# EAGLE design XuLA (EAGLE 5.10)
AUTHOR: Dave Vandenbout / XESS Corp.; DIGIKEY#: 445-3447-1-ND; MANF: Winbond; MANF#: C1005Y5V1H103Z; MOUSER#: 810-C1005Y5V1H103Z; VERSION#: 1.0

## Sheet 1 of 2
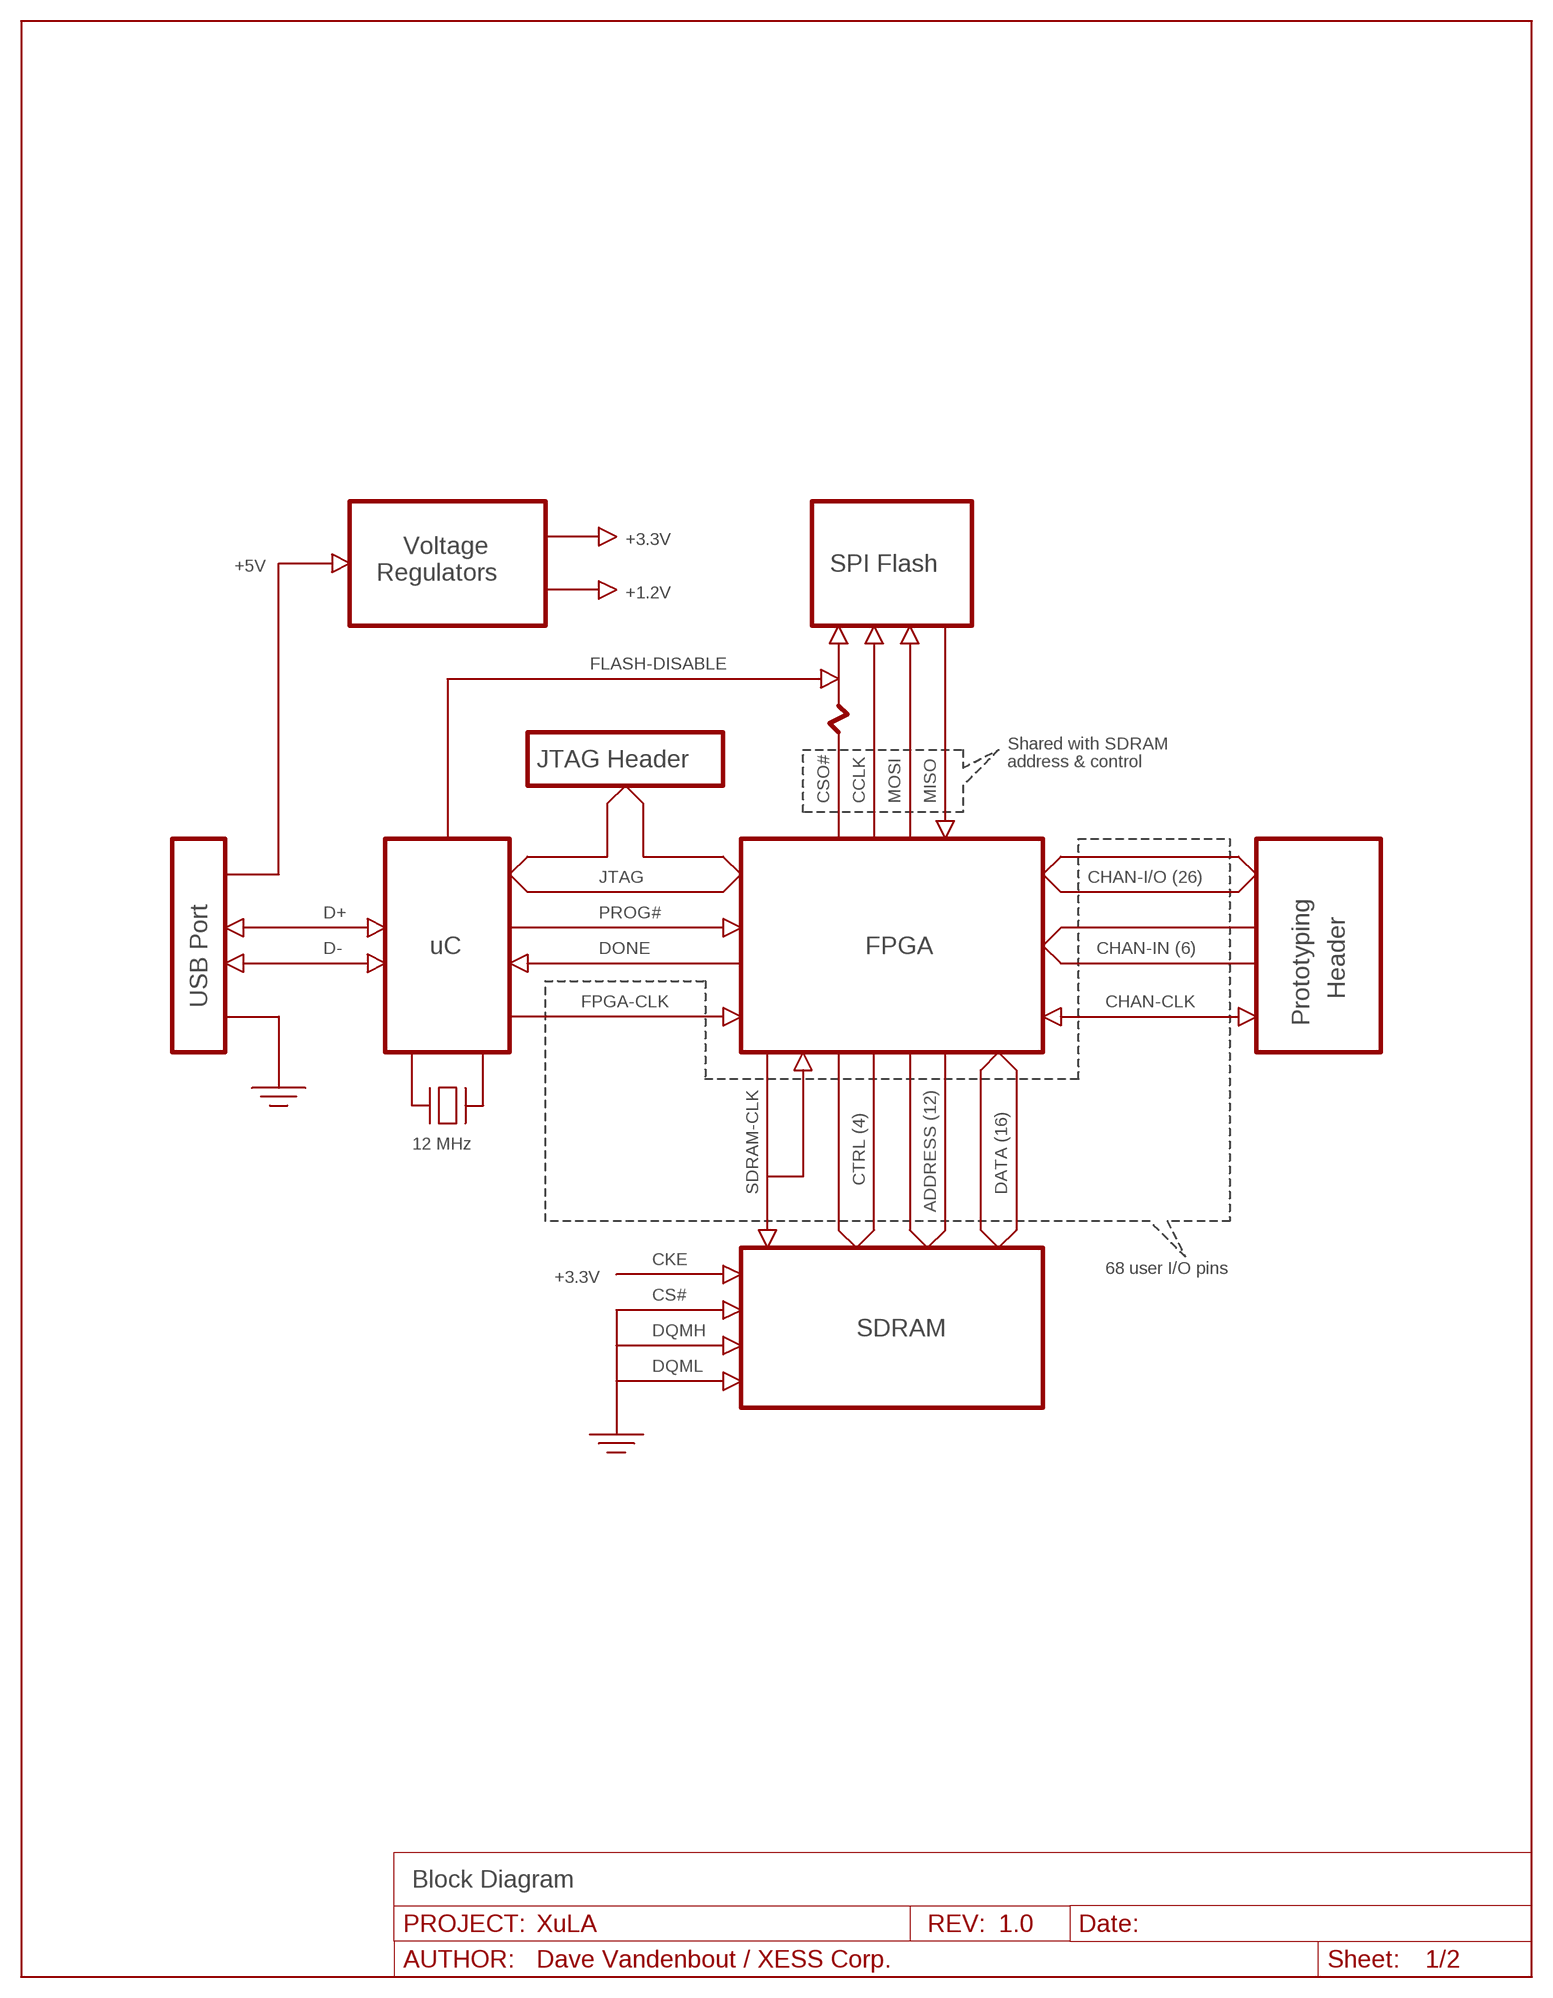
[diagram p0: schematic, sheet 1]

### Notes on the sheet
- +3.3V
- Voltage
- +5V | SPI Flash
- Regulators
- +1.2V
- FLASH-DISABLE
- Shared with SDRAM
- JTAG Header | address & control
- CSO# | CCLK | MOSI | MISO
- JTAG | CHAN-I/O (26)
- D+ | PROG#
- D- | uC | DONE | FPGA | CHAN-IN (6)
- Header
- USB Port | FPGA-CLK | CHAN-CLK
- Prototyping
- 12 MHz
- CTRL (4)
- SDRAM-CLK | DATA (16)
- ADDRESS (12)
- CKE
- 68 user I/O pins
- +3.3V
- CS#
- DQMH | SDRAM
- DQML
- Block Diagram

## Sheet 2 of 2
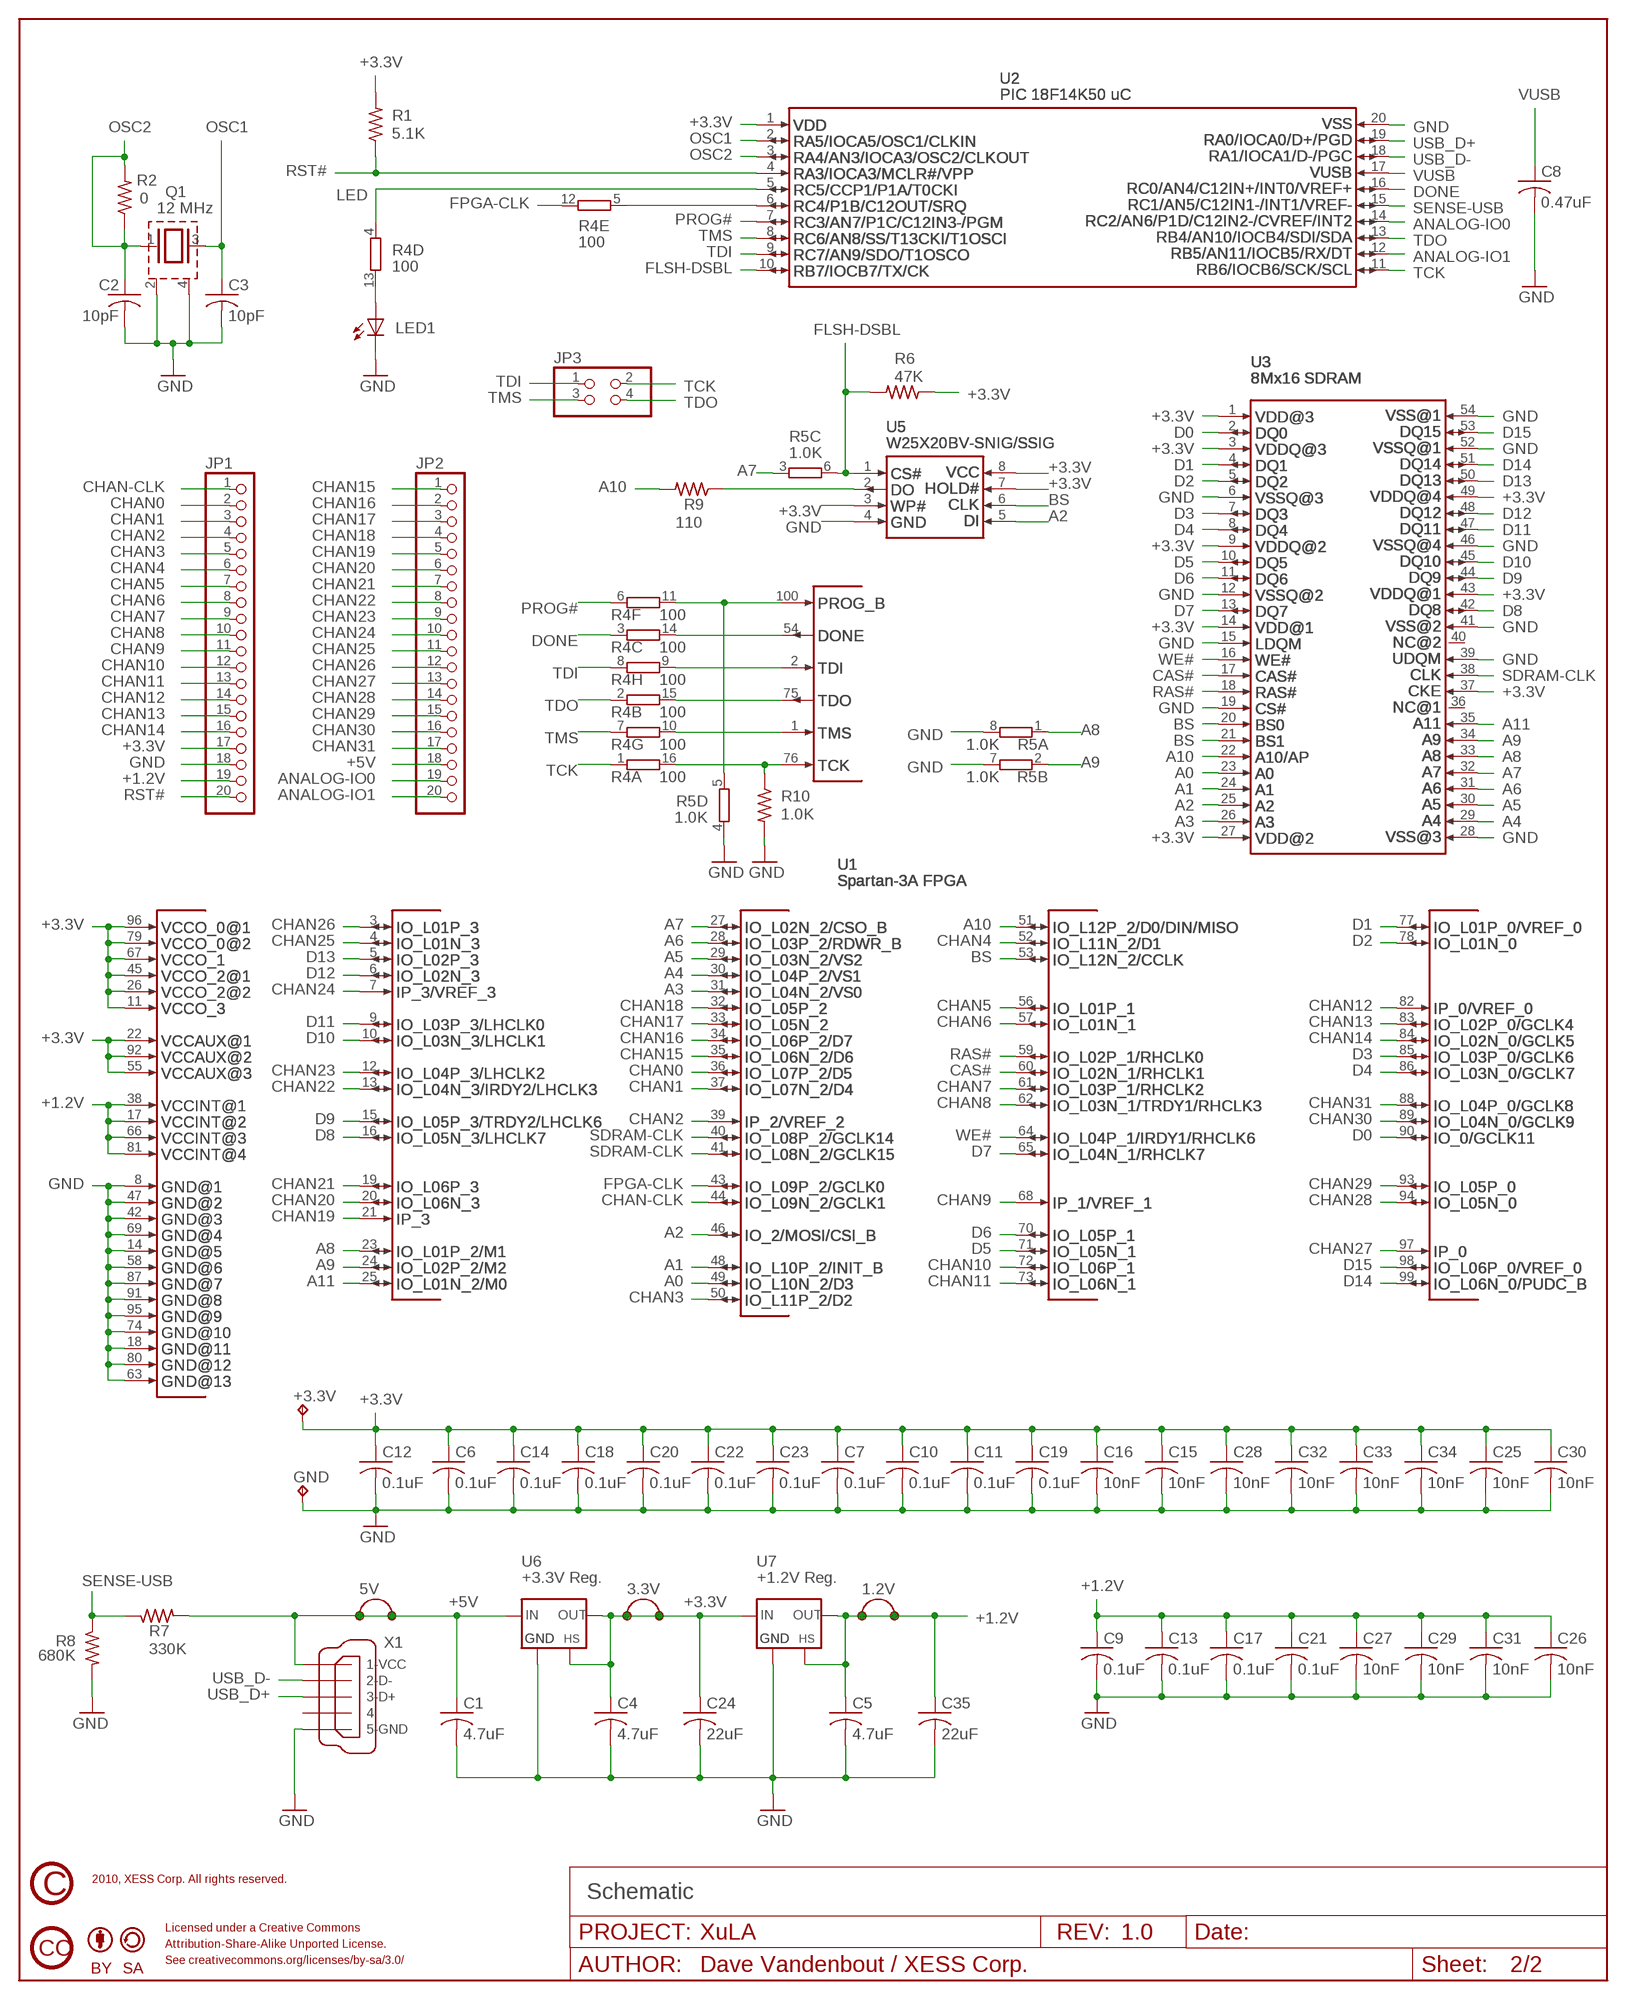
[diagram p1: schematic, sheet 2]

### Parts
1.2V  JP1QNOSILK  [JP1-NOSILK]
3.3V  JP1QNOSILK  [JP1-NOSILK]
5V  JP1QNOSILK  [JP1-NOSILK]
+3.3V  TPTP-MINI  [TP-MINI]
C1  4.7uF  C-USC0603  [C0603]
C2  10pF  C-USC0603  [C0603]
C3  10pF  C-USC0603  [C0603]
C4  4.7uF  C-USC0603  [C0603]
C5  4.7uF  C-USC0603  [C0603]
C6  0.1uF  C-USC0603  [C0603]
C7  0.1uF  C-USC0603  [C0603]
C8  0.47uF  C-USC0603  [C0603]
C9  0.1uF  C-USC0603  [C0603]
C10  0.1uF  C-USC0603  [C0603]
C11  0.1uF  C-USC0603  [C0603]
C12  0.1uF  C-USC0603  [C0603]
C13  0.1uF  C-USC0603  [C0603]
C14  0.1uF  C-USC0603  [C0603]
C15  10nF  C-USC0402  [C0402]
C16  10nF  C-USC0402  [C0402]
C17  0.1uF  C-USC0603  [C0603]
C18  0.1uF  C-USC0603  [C0603]
C19  0.1uF  C-USC0603  [C0603]
C20  0.1uF  C-USC0603  [C0603]
C21  0.1uF  C-USC0603  [C0603]
C22  0.1uF  C-USC0603  [C0603]
C23  0.1uF  C-USC0603  [C0603]
C24  22uF  C-USC1210  [C1210]
C25  10nF  C-USC0402  [C0402]
C26  10nF  C-USC0402  [C0402]
C27  10nF  C-USC0402  [C0402]
C28  10nF  C-USC0402  [C0402]
C29  10nF  C-USC0402  [C0402]
C30  10nF  C-USC0402  [C0402]
C31  10nF  C-USC0402  [C0402]
C32  10nF  C-USC0402  [C0402]
C33  10nF  C-USC0402  [C0402]
C34  10nF  C-USC0402  [C0402]
C35  22uF  C-USC1210  [C1210]
GND  TPTP-MINI  [TP-MINI]
JP1  PINHD-1X20NOSILK  [1X20-NOSILK]
JP2  PINHD-1X20NOSILK  [1X20-NOSILK]
JP3  PINHD-2X2NOSILK  [2X02-NOSILK]
LED1  LED0603  [CHIPLED-0603-TTW]
Q1  12 MHz  XTAL_CHIP32X25  [32X25]
R1  5.1K  R-US_R0603  [R0603]
R2  0  R-US_R0603  [R0603]
R4  100  RES8741X  [741X163]
R5  1.0K  RES4742  [742C083]
R6  47K  R-US_R0603  [R0603]
R7  330K  R-US_R0603  [R0603]
R8  680K  R-US_R0603  [R0603]
R9  110  R-US_R0603  [R0603]
R10  1.0K  R-US_R0603  [R0603]
U1  Spartan-3A FPGA  XC3S200A-VQ100  [XILINX-VQ100]
U2  PIC 18F14K50 uC  PIC18F14K50-I/SS  [MICROCHIP-20_SSOP]
U3  8Mx16 SDRAM  W9812G6JH  [TSOPII-54]
U5  W25X20BV-SNIG/SSIG  W25X10BV-SNIG/SSIG  [WINBOND-8_SOIC_150_208]
U6  +3.3V Reg.  FAN1117  [SOT223]
U7  +1.2V Reg.  FAN1112  [SOT223]
U$2  CC_CC  [CC_CC]
U$3  CC_BY  [CC_BY]
U$4  CC_SA  [CC_SA]
U$5  CC_COPYRIGHT  [CC_COPYRIGHT]
X1  MINI-USB-UX60SC-MB-5STUX60SC-MB-5ST  [UX60SC-MB-5ST]

### Nets
+1.2V: 1.2V.1 1.2V.2 C5.1 C9.1 C13.1 C17.1 C21.1 C26.1 C27.1 C29.1 C31.1 C35.1 JP1.19 U1.17 U1.38 U1.66 U1.81 U7.2(OUT) U7.4(HS)
+3.3V: 3.3V.1 3.3V.2 +3.3V.1(TP) C4.1 C6.1 C7.1 C10.1 C11.1 C12.1 C14.1 C15.1 C16.1 C18.1 C19.1 C20.1 C22.1 C23.1 C24.1 C25.1 C28.1 C30.1 C32.1 C33.1 C34.1 JP1.17 R1.2 R6.1 U1.11 U1.22 U1.26 U1.45 U1.55 U1.67 U1.79 U1.92 U1.96 U2.1 U3.1 U3.3 U3.9 U3.14 U3.27 U3.37 U3.43 U3.49 U5.3 U5.7 U5.8 U6.2(OUT) U6.4(HS) U7.3(IN)
+5V: 5V.1 5V.2 C1.1 JP2.18 R7.2 U6.3(IN) X1.1(1-VCC)
A0: U1.49 U3.23
A1: U1.48 U3.24
A2: U1.46 U3.25 U5.5
A3: U1.31 U3.26
A4: U1.30 U3.29
A5: U1.29 U3.30
A6: U1.28 U3.31
A7: R5.3 U1.27 U3.32
A8: R5.1 U1.23 U3.33
A9: R5.2 U1.24 U3.34
A10: R9.2 U1.51 U3.22
A11: U1.25 U3.35
ANALOG-IO0: JP2.19 U2.14
ANALOG-IO1: JP2.20 U2.12
BS: U1.53 U3.20 U3.21 U5.6
CAS#: U1.60 U3.17
CHAN0: JP1.2 U1.36
CHAN1: JP1.3 U1.37
CHAN2: JP1.4 U1.39
CHAN3: JP1.5 U1.50
CHAN4: JP1.6 U1.52
CHAN5: JP1.7 U1.56
CHAN6: JP1.8 U1.57
CHAN7: JP1.9 U1.61
CHAN8: JP1.10 U1.62
CHAN9: JP1.11 U1.68
CHAN10: JP1.12 U1.72
CHAN11: JP1.13 U1.73
CHAN12: JP1.14 U1.82
CHAN13: JP1.15 U1.83
CHAN14: JP1.16 U1.84
CHAN15: JP2.1 U1.35
CHAN16: JP2.2 U1.34
CHAN17: JP2.3 U1.33
CHAN18: JP2.4 U1.32
CHAN19: JP2.5 U1.21
CHAN20: JP2.6 U1.20
CHAN21: JP2.7 U1.19
CHAN22: JP2.8 U1.13
CHAN23: JP2.9 U1.12
CHAN24: JP2.10 U1.7
CHAN25: JP2.11 U1.4
CHAN26: JP2.12 U1.3
CHAN27: JP2.13 U1.97
CHAN28: JP2.14 U1.94
CHAN29: JP2.15 U1.93
CHAN30: JP2.16 U1.89
CHAN31: JP2.17 U1.88
CHAN-CLK: JP1.1 U1.44
D0: U1.90 U3.2
D1: U1.77 U3.4
D2: U1.78 U3.5
D3: U1.85 U3.7
D4: U1.86 U3.8
D5: U1.71 U3.10
D6: U1.70 U3.11
D7: U1.65 U3.13
D8: U1.16 U3.42
D9: U1.15 U3.44
D10: U1.10 U3.45
D11: U1.9 U3.47
D12: U1.6 U3.48
D13: U1.5 U3.50
D14: U1.99 U3.51
D15: U1.98 U3.53
DONE: R4.3 U2.16
FLSH-DSBL: R5.6 R6.2 U2.10 U5.1
FPGA-CLK: R4.12 U1.43
GND: C1.2 C2.2 C3.2 C4.2 C5.2 C6.2 C7.2 C8.2 C9.2 C10.2 C11.2 C12.2 C13.2 C14.2 C15.2 C16.2 C17.2 C18.2 C19.2 C20.2 C21.2 C22.2 C23.2 C24.2 C25.2 C26.2 C27.2 C28.2 C29.2 C30.2 C31.2 C32.2 C33.2 C34.2 C35.2 GND.1(TP) JP1.18 LED1.C Q1.2 Q1.4 R5.4 R5.7 R5.8 R8.2 R10.2 U1.8 U1.14 U1.18 U1.42 U1.47 U1.58 U1.63 U1.69 U1.74 U1.80 U1.87 U1.91 U1.95 U2.20 U3.6 U3.12 U3.15 U3.19 U3.28 U3.39 U3.41 U3.46 U3.52 U3.54 U5.4 U6.1(GND) U7.1(GND) X1.5(5-GND)
LED: R4.4 U2.5
N$1: R4.16 R10.1 U1.76
N$2: R4.10 U1.1
N$3: R4.9 U1.2
N$4: R4.15 U1.75
N$5: R4.11 R5.5 U1.100
N$6: R4.14 U1.54
N$7: R4.5 U2.6
N$8: R9.1 U5.2
N$11: LED1.A R4.13
OSC1: C3.1 Q1.3 U2.2
OSC2: C2.1 Q1.1 R2.1 R2.2 U2.3
PROG#: R4.6 U2.7
RAS#: U1.59 U3.18
RST#: JP1.20 R1.1 U2.4
SDRAM-CLK: U1.40 U1.41 U3.38
SENSE-USB: R7.1 R8.1 U2.15
TCK: JP3.2 R4.1 U2.11
TDI: JP3.1 R4.8 U2.9
TDO: JP3.4 R4.2 U2.13
TMS: JP3.3 R4.7 U2.8
USB_D+: U2.19 X1.3(3-D+)
USB_D-: U2.18 X1.2(2-D-)
VUSB: C8.1 U2.17
WE#: U1.64 U3.16
Unconnected: U3.36 U3.40 X1.4

### Notes on the sheet
- 2010, XESS Corp. All rights reserved.
- Schematic
- Licensed under a Creative Commons
- Attribution-Share-Alike Unported License.
- See creativecommons.org/licenses/by-sa/3.0/

## Library data of the parts
1.2V 3.3V 5V = xess:JP1Q: JUMPER
+3.3V GND = xess:TP: Test Point
C1-C35 = rcl:C-US: CAPACITOR, American symbol
JP1 JP2 = pinhead:PINHD-1X20: PIN HEADER
JP3 = pinhead:PINHD-2X2: PIN HEADER
LED1 = xess:LED: LED
Q1 = xess:XTAL_CHIP: Crystal Chip
R1 R2 R6-R10 = rcl:R-US_: RESISTOR, American symbol
R4 = xess:RES8: Resistor 8-pack Package of eight resistors.
R5 = xess:RES4: Resistor 4-pack Package of four resistors.
U1 = xess:XC3S200A-VQ100: Xilinx Spartan 3A 200K-gate FPGA in VQ100 package
U2 = xess:PIC18F14K50: Microchip PIC 18F14K50 Microcontroller
U3 = xess:W9812G6JH: 8M x 16 SDRAM 128Mb synchronous DRAM.
U5 = xess:W25X10BV: Winbond W25X10BV/20BV/40BV SPI Flash
U6 = xess:FAN1117: +3.3V Linear Regulator
U7 = xess:FAN1112: +1.2V Linear Regulator
U$2 = xess:CC_CC
U$3 = xess:CC_BY
U$4 = xess:CC_SA
U$5 = xess:CC_COPYRIGHT
X1 = xess:MINI-USB-: MINI USB Connector Source: http://www.hirose.co.jp/cataloge_hp/e24000019.pdf

## Net classes
1 power: clearance 0.254 mm

## Board
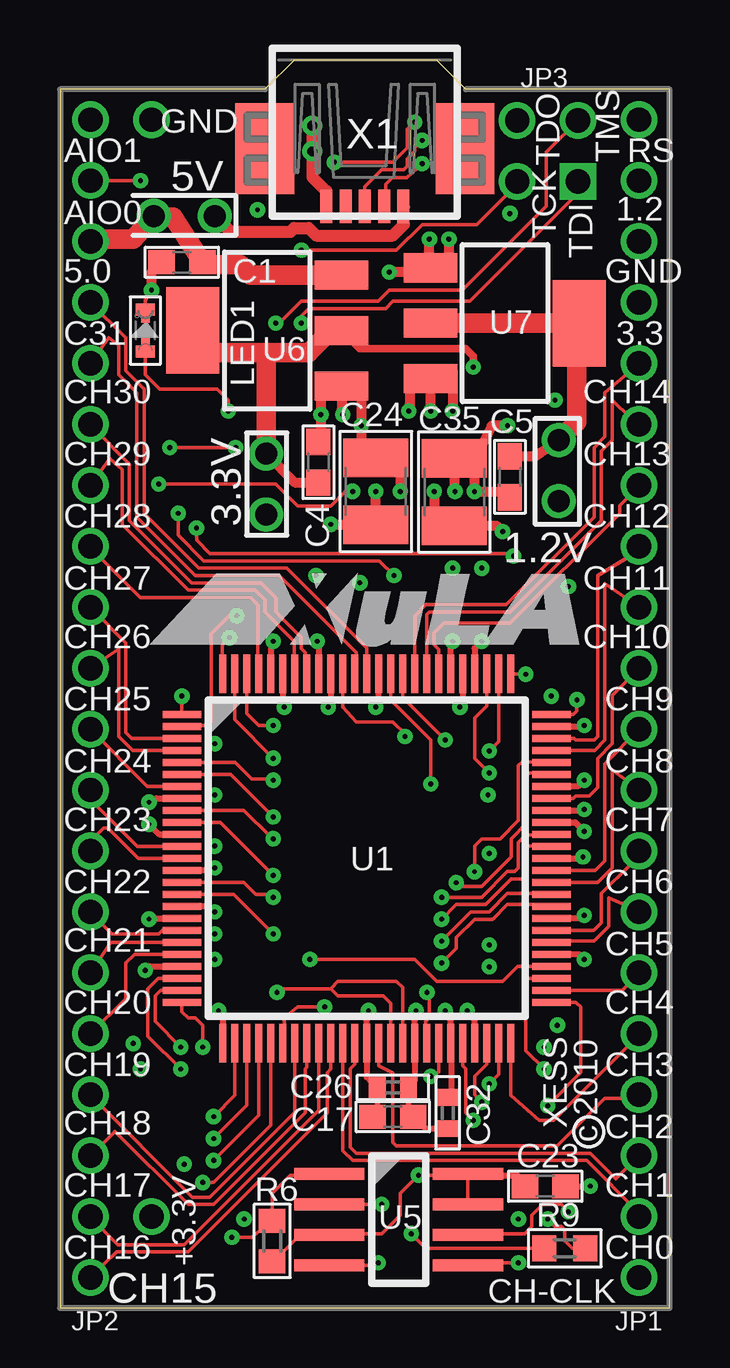
[diagram p2: board, top side]
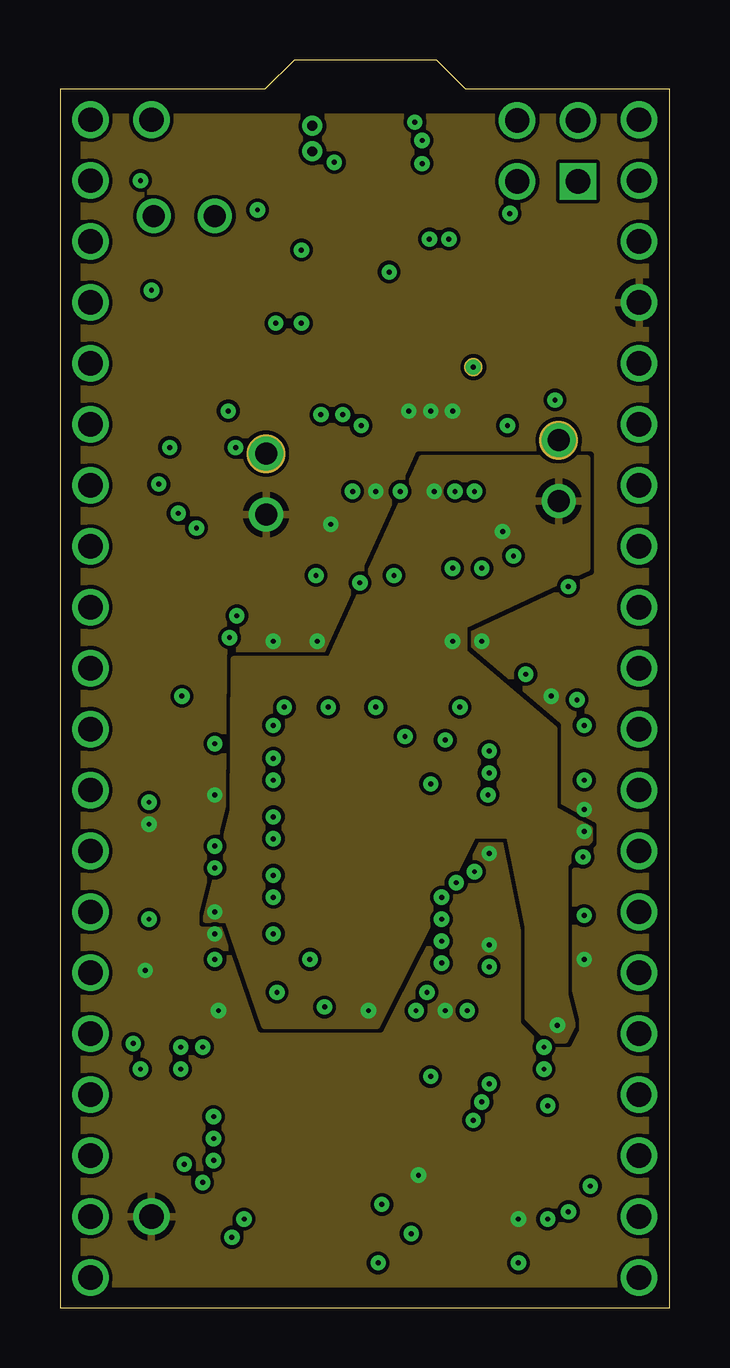
[diagram p3: board, inner layer Route3]
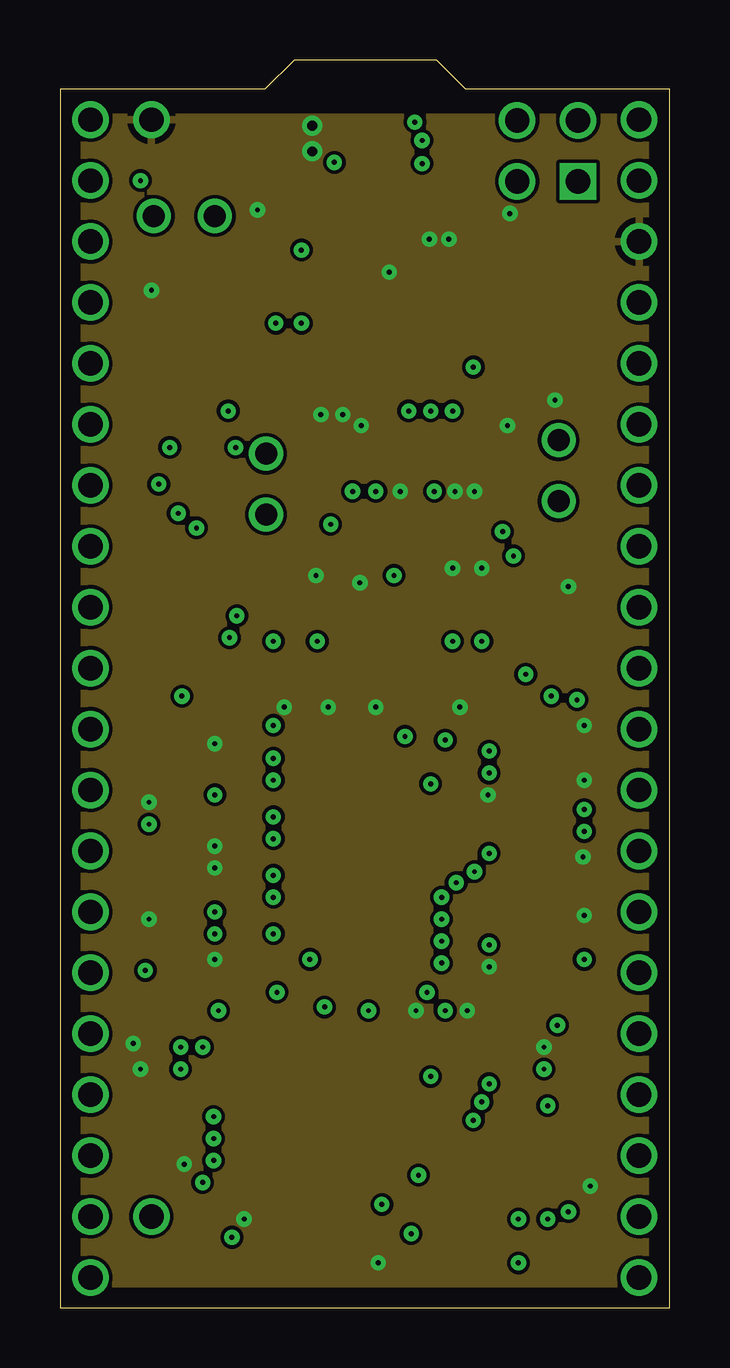
[diagram p4: board, inner layer Route4]
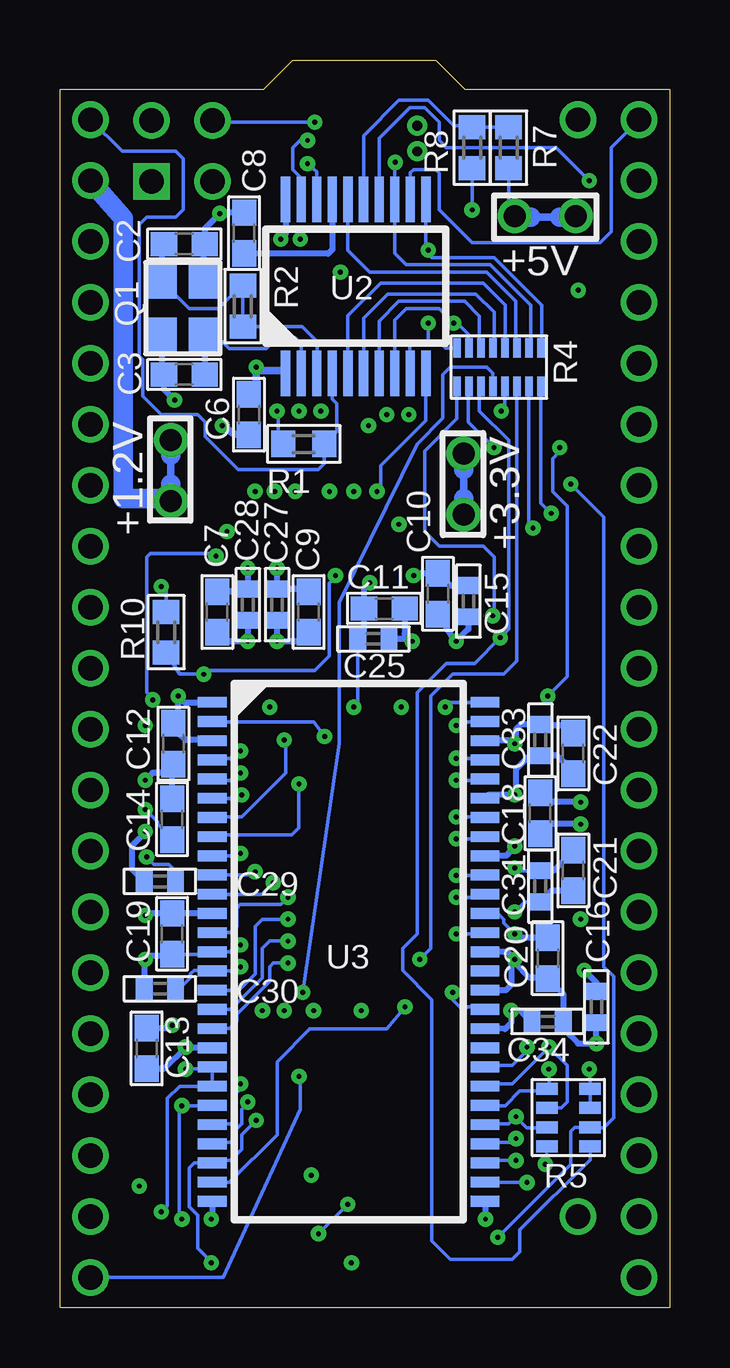
[diagram p5: board, bottom side, seen from below]

Size 25.4 x 52.02 mm. Coordinates in mm from the lower left corner, seen from the top.
Outline: 0,50.8 0,0 25.4,0 25.4,50.8 16.92,50.8 15.7,52.02 9.75,52.02 8.53,50.8 0,50.8
Copper layers (1+3*4+16): Top 0.035mm / dielectric 0.3048mm / Route3 0.07mm / dielectric 0.3048mm / Route4 0.07mm / dielectric 0.3048mm / Bottom 0.035mm
Design rules "logic_popper": minimum track width 6mil, minimum drill 8mil, track to track 6mil, track to pad 6mil, pad to pad 6mil, via to via 6mil, smd to smd 6mil, copper to edge 20mil, drill to drill 8mil, minimum pad ring 10mil, minimum via ring 8.5mil, stop-mask expansion 4mil, vias tented up to drill 20mil, thermal gap 10mil

### Footprints (pad centres in the part's own frame; a part is rotated, then mirrored left to right if it is on the bottom)
JP1-NOSILK = drill 0.914 round: 1 0,-1.27; 2 0,1.27
TP-MINI = drill 1.016 round: 1 0,0
C0603 = smd 1.1 x 1: 1 -0.85,0; 2 0.85,0
C0402 = smd 0.7 x 0.9: 1 -0.65,0; 2 0.65,0
C1210 = smd 1.6 x 2.7: 1 -1.4,0; 2 1.4,0
1X20-NOSILK = drill 1.016 round: 1 -24.13,0; 2 -21.59,0; 3 -19.05,0; 4 -16.51,0; 5 -13.97,0; 6 -11.43,0; 7 -8.89,0; 8 -6.35,0; 9 -3.81,0; 10 -1.27,0; 11 1.27,0; 12 3.81,0; 13 6.35,0; 14 8.89,0; 15 11.43,0; 16 13.97,0; 17 16.51,0; 18 19.05,0; 19 21.59,0; 20 24.13,0
2X02-NOSILK = drill 1.016 square: 1 -1.27,-1.27 | drill 1.016 round: 2 -1.27,1.27; 3 1.27,-1.27; 4 1.27,1.27
CHIPLED-0603-TTW = smd 0.8 x 0.5: A 0,-0.875; C 0,0.875 | smd 0.35 x 0.35: A@1 0,-0.5; C@1 0,0.5
32X25 = smd 1.2 x 1.4: 1 0,0; 2 0,-2.2; 3 1.7,-2.2; 4 1.7,0
R0603 = smd 1 x 1.1: 1 -0.85,0; 2 0.85,0
741X163 = smd 0.3 x 0.8: 1 -1.75,-0.8; 2 -1.25,-0.8; 3 -0.75,-0.8; 4 -0.25,-0.8; 5 0.25,-0.8; 6 0.75,-0.8; 7 1.25,-0.8; 8 1.75,-0.8; 9 1.75,0.8; 10 1.25,0.8; 11 0.75,0.8; 12 0.25,0.8; 13 -0.25,0.8; 14 -0.75,0.8; 15 -1.25,0.8; 16 -1.75,0.8
742C083 = smd 0.5 x 0.9: 1 -0.4,-0.9; 2 0.4,-0.9; 3 1.2,-0.9; 4 2,-0.9; 5 2,0.9; 6 1.2,0.9; 7 0.4,0.9; 8 -0.4,0.9
XILINX-VQ100 = smd 1.6 x 0.3: 1 0,0; 2 0,-0.5; 3 0,-1; 4 0,-1.5; 5 0,-2; 6 0,-2.5; 7 0,-3; 8 0,-3.5; 9 0,-4; 10 0,-4.5; 11 0,-5; 12 0,-5.5; 13 0,-6; 14 0,-6.5; 15 0,-7; 16 0,-7.5; 17 0,-8; 18 0,-8.5; 19 0,-9; 20 0,-9.5; 21 0,-10; 22 0,-10.5; 23 0,-11; 24 0,-11.5; 25 0,-12; 51 15.4,-12; 52 15.4,-11.5; 53 15.4,-11; 54 15.4,-10.5; 55 15.4,-10; 56 15.4,-9.5; 57 15.4,-9; 58 15.4,-8.5; 59 15.4,-8; 60 15.4,-7.5; 61 15.4,-7; 62 15.4,-6.5; 63 15.4,-6; 64 15.4,-5.5; 65 15.4,-5; 66 15.4,-4.5; 67 15.4,-4; 68 15.4,-3.5; 69 15.4,-3; 70 15.4,-2.5; 71 15.4,-2; 72 15.4,-1.5; 73 15.4,-1; 74 15.4,-0.5; 75 15.4,0 | smd 0.3 x 1.6: 26 1.7,-13.7; 27 2.2,-13.7; 28 2.7,-13.7; 29 3.2,-13.7; 30 3.7,-13.7; 31 4.2,-13.7; 32 4.7,-13.7; 33 5.2,-13.7; 34 5.7,-13.7; 35 6.2,-13.7; 36 6.7,-13.7; 37 7.2,-13.7; 38 7.7,-13.7; 39 8.2,-13.7; 40 8.7,-13.7; 41 9.2,-13.7; 42 9.7,-13.7; 43 10.2,-13.7; 44 10.7,-13.7; 45 11.2,-13.7; 46 11.7,-13.7; 47 12.2,-13.7; 48 12.7,-13.7; 49 13.2,-13.7; 50 13.7,-13.7; 76 13.7,1.7; 77 13.2,1.7; 78 12.7,1.7; 79 12.2,1.7; 80 11.7,1.7; 81 11.2,1.7; 82 10.7,1.7; 83 10.2,1.7; 84 9.7,1.7; 85 9.2,1.7; 86 8.7,1.7; 87 8.2,1.7; 88 7.7,1.7; 89 7.2,1.7; 90 6.7,1.7; 91 6.2,1.7; 92 5.7,1.7; 93 5.2,1.7; 94 4.7,1.7; 95 4.2,1.7; 96 3.7,1.7; 97 3.2,1.7; 98 2.7,1.7; 99 2.2,1.7; 100 1.7,1.7
MICROCHIP-20_SSOP = smd 1.89 x 0.38: 1 0,0; 2 0,-0.65; 3 0,-1.3; 4 0,-1.95; 5 0,-2.6; 6 0,-3.25; 7 0,-3.9; 8 0,-4.55; 9 0,-5.2; 10 0,-5.85; 11 7.25,-5.85; 12 7.25,-5.2; 13 7.25,-4.55; 14 7.25,-3.9; 15 7.25,-3.25; 16 7.25,-2.6; 17 7.25,-1.95; 18 7.25,-1.3; 19 7.25,-0.65; 20 7.25,0
TSOPII-54 = smd 1.2 x 0.45: 1 0,0; 2 0,-0.8; 3 0,-1.6; 4 0,-2.4; 5 0,-3.2; 6 0,-4; 7 0,-4.8; 8 0,-5.6; 9 0,-6.4; 10 0,-7.2; 11 0,-8; 12 0,-8.8; 13 0,-9.6; 14 0,-10.4; 15 0,-11.2; 16 0,-12; 17 0,-12.8; 18 0,-13.6; 19 0,-14.4; 20 0,-15.2; 21 0,-16; 22 0,-16.8; 23 0,-17.6; 24 0,-18.4; 25 0,-19.2; 26 0,-20; 27 0,-20.8; 28 11.36,-20.8; 29 11.36,-20; 30 11.36,-19.2; 31 11.36,-18.4; 32 11.36,-17.6; 33 11.36,-16.8; 34 11.36,-16; 35 11.36,-15.2; 36 11.36,-14.4; 37 11.36,-13.6; 38 11.36,-12.8; 39 11.36,-12; 40 11.36,-11.2; 41 11.36,-10.4; 42 11.36,-9.6; 43 11.36,-8.8; 44 11.36,-8; 45 11.36,-7.2; 46 11.36,-6.4; 47 11.36,-5.6; 48 11.36,-4.8; 49 11.36,-4; 50 11.36,-3.2; 51 11.36,-2.4; 52 11.36,-1.6; 53 11.36,-0.8; 54 11.36,0
WINBOND-8_SOIC_150_208 = smd 2.921 x 0.51: 1 1.06,0; 2 1.06,-1.27; 3 1.06,-2.54; 4 1.06,-3.81; 5 6.839,-3.81; 6 6.839,-2.54; 7 6.839,-1.27; 8 6.839,0
SOT223 = smd 1.219 x 2.235: 1 -2.311,-3.099; 2 0,-3.099; 3 2.311,-3.099 | smd 3.6 x 2.2: 4 0,3.099
UX60SC-MB-5ST = smd 1.4 x 0.5: 1 6.1,1.6; 2 6.1,0.8; 3 6.1,0; 4 6.1,-0.8; 5 6.1,-1.6 | smd 3.8 x 2.449: M1 3.7,-4.175; M2 3.7,4.175

### Placement (x,y rotation side)
1.2V  20.78,34.9 180 top
3.3V  8.59,34.34 180 top
5V  5.18,45.52 90 top
+3.3V  3.81,3.81 270 top
C1  5.08,43.59 180 top
C2  20.22,44.35 0 bottom
C3  20.22,38.91 180 bottom
C4  10.77,35.26 90 top
C5  18.75,34.65 270 top
C6  17.53,37.24 270 bottom
C7  18.85,29.01 90 bottom
C8  17.73,44.81 90 bottom
C9  15.04,29.01 90 bottom
C10  9.65,29.77 90 bottom
C11  11.89,29.16 180 bottom
C12  20.68,23.52 270 bottom
C13  21.79,10.82 270 bottom
C14  20.73,20.37 90 bottom
C15  8.38,29.46 90 bottom
C16  3.05,12.55 270 bottom
C17  13.87,7.98 0 top
C18  5.38,20.62 90 bottom
C19  20.73,15.6 90 bottom
C20  5.08,14.58 270 bottom
C21  4.01,18.24 90 bottom
C22  4.01,23.11 90 bottom
C23  20.22,5.08 0 top
C24  13.16,34.04 90 top
C25  12.34,27.89 180 bottom
C26  13.87,9.19 0 top
C27  16.36,29.31 90 bottom
C28  17.58,29.31 90 bottom
C29  21.23,17.78 0 bottom
C30  21.23,13.31 0 bottom
C31  5.38,17.58 90 bottom
C32  16.15,8.13 270 top
C33  5.38,23.67 90 bottom
C34  5.08,11.94 0 bottom
C35  16.43,34.01 90 top
GND  3.81,49.53 270 top
JP1  24.13,25.4 90 top
JP2  1.27,25.4 90 top
JP3  20.32,48.23 90 top
LED1  3.56,40.74 0 top
Q1  21.13,42.77 0 bottom
R1  15.24,36.02 180 bottom
R2  17.78,41.76 90 bottom
R4  7.11,39.22 180 bottom
R5  4.22,8.74 270 bottom
R6  8.84,2.79 90 top
R7  6.71,48.36 270 bottom
R8  8.23,48.36 270 bottom
R9  21.03,2.49 0 top
R10  20.98,28.17 90 bottom
U1  5.08,24.74 0 top
U2  16,38.96 90 bottom
U3  19.05,25.25 0 bottom
U5  10.16,5.59 0 top
U6  8.64,40.74 90 top
U7  18.54,41.05 270 top
U$2  -1.91,-15.88 0 top  (outside the outline)
U$3  5.08,-14.61 0 top  (outside the outline)
U$4  10.16,-14.61 0 top  (outside the outline)
U$5  -1.91,-6.99 0 top  (outside the outline)
X1  12.7,52.02 270 top

### Tracks (layer width: path | path; a pad name or v marks a point on that pad's centre or on a via)
+1.2V  (via drill 0.2)
  Top 0.152: 16.43,27.71
  Top 0.254: v12.85,12.39 12.78,12.32 U1.38 12.78,9.63 C26.1 13.22,8.18 C17.1 | U1.17 6.22,16.74 v6.45,16.51 | 16.43,27.71 16.26,27.64 16.26,26.72 U1.81 | v16.36,27.79 16.43,27.71 | U1.66 21.47,20.24 v21.84,19.86
  Top 0.305: 15.6,33.07 15.7,32.97 16.07,32.97 C35.1
  Top 0.406: C5.1 19.8,35.5 1.2V.1 | v15.6,34.04 15.6,33.07 | C35.1 18.19,32.61 v18.44,32.36
  Top 0.813: U7.2 U7.4 21.54,41.4 21.54,36.93 1.2V.1
  Bottom 0.152: C31.1 6.04,16.93 v6.45,16.51 | v21.84,19.86 21.84,19.81 | C9.1 15.41,27.79
  Bottom 0.254: C21.1 4.92,17.39 C31.1 | 21.84,19.81 22.4,19.25 22.4,18.3 C29.1 | C13.1 20.84,11.67 v20.73,11.79 | C27.1 v16.36,27.79 15.41,27.79
  Bottom 0.305: 20.78,35.56 20.78,34.34
  Bottom 0.813: JP1.19 22.76,45.41 22.76,33.73 20.93,33.73 20.83,33.63 1.2V.2 20.78,34.34 | 1.2V.1 20.78,35.56
  pour Route3 (rank 3): 15.09,35.41 11.28,27.03 7.26,27.03 7.21,20.73 6.1,16.21 7.01,16.21 8.53,11.79 13.21,11.79 17.22,19.71 18.75,19.71 19.51,15.9 19.51,12.09 20.42,11.18 21.03,11.18 21.34,11.79 21.03,13 21.03,18.49 22.05,19.51 22.05,19.96 20.57,20.78 20.57,24.13 16.81,27.33 16.81,28.45 21.95,30.84 21.95,35.41
+3.3V  (via drill 0.2)
  Top 0.152: U1.26 6.76,11.02 | U5.8 U5.7 | U5.8 17,5.54 v14.94,5.54 14.17,4.78 14.17,3.86 13.41,3.1 11.27,3.1 U5.3 11.12,2.95 9.91,2.95 8.9,1.94 R6.1 | U5.8 17.05,5.54 | C32.1 16.15,8.74 16.31,8.89 | U1.45 16.31,11.01
  Top 0.254: U1.26 6.78,12.22 v6.6,12.39 | U1.79 17.28,27.49 v17.58,27.79 | U1.67 21.73,20.74 v21.84,20.78 | U1.45 16.28,12.32 v16.05,12.39 | U1.11 4.14,19.74 v3.71,20.17 | U1.96 8.78,27.68 v8.89,27.79 | U1.92 10.78,27.88 v10.72,27.79 | U1.22 3.72,14.24 v3.56,14.07 | C23.1 19.37,5.22 19.05,5.54 17.05,5.54 | U1.55 21.63,14.74 v21.84,14.53 | 16.31,11.01 16.31,8.89
  Top 0.305: 16.36,39.06 14.81,39.06 U7.3 | v17.22,39.22 17.22,39.67 16.92,39.98 12.5,39.98 U6.2
  Top 0.406: C24.1 13.89,32.64 13.25,32.65 | 13.25,32.65 13.16,32.66 v13.16,34.04 | 15.42,38.91 15.42,37.41 v15.44,37.39 | 14.58,38.61 14.58,37.44 v14.53,37.39 | 16.36,39.06 v16.36,37.39 | C4.1 9.79,34.41 3.3V.1 | 13.25,32.65 11.14,32.65 v11.28,32.66
  Top 0.813: U7.3 15.42,38.91 | U6.2 11.28,40.74 10.36,39.83 8.53,39.83 | 8.53,39.83 6.45,39.83 U6.4 | 3.3V.1 8.59,39.78 8.53,39.83
  Bottom 0.152: 6.41,21.35 v6.45,21.39 6.4,21.54 | 7.55,21.39 U3.49 | 7.2,11.65 U3.37 | v17.88,18.95 17.98,18.85 U3.9 19.1,18.8 | 20.36,23.86 C12.1 20.47,23.91 | U3.3 19.07,23.67 | U3.43 7.15,16.45 6.91,16.2 6.91,16.05 v6.45,15.6 | v17.88,15.14 18.03,15.14 18.32,14.85 U3.14 19.15,14.75 C19.1 20.79,14.68 | C34.1 5.99,11.94 5.99,12.14 | C33.1 5.83,23.02 | 4.68,23.02 4.57,22.91 | 4.17,22.57 C22.1 | C14.1 20.73,19.56 21.34,20.17 21.34,20.27 v21.84,20.78 | v21.84,14.53 21.88,14.49 | 21.79,14.68 21.84,14.63 | 4.99,20.17 C18.1 | C7.1 18.81,28.16 18.44,27.79 | R1.2 16.09,36.1 16.31,36.32 16.31,37.34 v16.36,37.39
  Bottom 0.254: v6.45,21.39 7.55,21.39 | C20.1 6.29,15.43 v6.45,15.6 | 7.2,11.65 6.86,11.63 6.6,11.89 v6.6,12.39 6.25,12.39 5.99,12.14 | 20.36,23.86 20.17,23.67 19.07,23.67 | U3.1 20.22,25.25 v20.47,25.5 20.47,23.91 | U3.27 19.05,3.91 v19.1,3.71 | 5.83,23.02 6.4,22.45 6.4,21.54 | 4.57,22.91 4.17,22.57 | 4.68,23.02 C33.1 | 21.88,14.49 C30.1 | 21.84,14.63 v21.84,14.53 | 20.79,14.68 21.79,14.68 | v3.71,20.17 4.99,20.17 | C25.1 10.82,27.89 v10.72,27.79 11.04,28.11 C11.1 | C10.1 9.04,27.94 v8.89,27.79 8.38,28.3 C15.1 | 18.44,27.79 v17.58,27.79 C28.1 | C16.1 3.05,13.56 v3.56,14.07
  Bottom 0.305: U3.27 19.07,4.47 | 8.59,34.95 8.59,33.73 | U2.1 15.95,38.96 16.05,39.06 17.07,39.06 v17.22,39.22 17.22,38.39 C6.1
  Bottom 0.813: 3.3V.1 8.59,34.95 | 8.59,33.73 3.3V.2
  pour Route3 (rank 6): 1.02,1.02 24.38,1.02 24.38,49.63 1.02,49.63
+5V
  Top 0.508: X1.1 14.33,45.89 14.33,45.16 13.87,44.7 10.67,44.7 10.36,45.01 9.75,45.01 9.6,44.86 7.11,44.86 5V.1
  Top 0.813: C1.1 5.84,43.67 | U6.3 7.95,43.05 7.52,43.48 6.03,43.48 C1.1 | JP2.18 1.37,44.55 3.05,44.55 5V.2 4.12,45.47 4.72,45.47 C1.1
  Bottom 0.152: R7.2 6.71,45.77 5V.1
  Bottom 0.305: 4.57,45.47 5.79,45.47
  Bottom 0.813: 5V.1 6.25,45.47 5.79,45.47 | 4.57,45.47 4.42,45.47 5V.2
A0  (via drill 0.2)
  Top 0.152: U1.49 18.28,9.75 v17.88,9.35
  Bottom 0.152: v17.88,9.35 17.88,9.14 18.14,8.89 18.14,7.82 18.29,7.67 19.03,7.67 U3.23
A1  (via drill 0.2)
  Top 0.152: U1.48 17.78,10.16 17.27,9.65 17.27,8.89 v17.58,8.59
  Bottom 0.152: v17.58,8.59 17.58,8.53 17.83,8.28 17.83,7.67 18.14,7.37 18.14,7.06 18.29,6.91 18.99,6.91 U3.24
A2  (via drill 0.2)
  Top 0.152: U1.46 16.78,10.09 16.92,9.96 16.92,8.13 v17.22,7.82 | v19.1,1.88 17.2,1.88 U5.5
  Bottom 0.152: v17.22,7.82 17.83,7.21 17.83,6.6 18.29,6.15 18.95,6.15 U3.25 19.81,6.05 20.02,5.84 20.02,4.22 19.66,3.86 19.66,2.49 19.2,2.03 19.2,1.98 v19.1,1.88
A3  (via drill 0.2)
  Top 0.152: v11.02,12.55 9.91,12.55 9.35,12.09 9.35,11.11 U1.31
  Bottom 0.152: U3.26 19.04,5.23 18.34,5.23 16.36,7.21 16.36,10.26 14.99,11.63 11.79,11.63 v11.02,12.55
A4  (via drill 0.2)
  Top 0.152: U1.30 8.78,7.61 6.4,5.23 v5.94,5.23
  Bottom 0.152: v5.94,5.23 7.67,5.23 U3.29
A5  (via drill 0.2)
  Top 0.152: U1.29 8.28,8.03 v6.4,6.15
  Bottom 0.152: v6.4,6.15 7.59,6.15 U3.30
A6  (via drill 0.2)
  Top 0.152: U1.28 7.78,8.44 v6.4,7.06
  Bottom 0.152: v6.4,7.06 6.55,6.91 7.63,6.91 U3.31
A7  (via drill 0.2)
  Top 0.152: U1.27 7.28,8.86 v6.4,7.98
  Bottom 0.152: U3.32 7.67,7.67 6.71,7.67 v6.4,7.98 5.94,7.52 5.55,7.52 R5.3
A8  (via drill 0.2)
  Top 0.152: U1.23 4.09,13.74 3.66,13.31 3.66,11.33 v5.03,9.96
  Bottom 0.152: U3.33 7.67,8.43 6.86,8.43 6.25,9.04 5.02,9.04 | 5.02,9.04 R5.1 | 5.02,9.04 v5.02,9.95 v5.03,9.96
A9  (via drill 0.2)
  Top 0.152: U1.24 4.2,13.24 3.96,13.01 3.96,11.94 v5.03,10.87
  Bottom 0.152: U3.34 7.59,9.35 6.55,9.35 v5.03,10.87 4.27,10.11 4.27,8.59 4.51,8.34 R5.2
A10  (via drill 0.2)
  Top 0.152: U1.51 21.5,12.74 21.69,12.55 21.7,9.81 v20.32,8.43 | R9.2 21.34,2.49 21.03,2.79 21.03,3.25 20.88,3.4 20.62,3.4 v20.32,3.71
  Bottom 0.152: 19.04,8.43 U3.22 19.07,8.43 v20.32,8.43 20.42,8.13 20.42,4.01 v20.32,3.71
A11  (via drill 0.2)
  Top 0.152: U1.25 5.08,12.34 5.33,12.09 5.64,12.09 5.94,11.79 v5.94,10.87
  Bottom 0.152: 7.78,9.96 U3.35 7.63,10.11 6.55,10.11 5.94,10.72 v5.94,10.87
ANALOG-IO0  (via drill 0.2)
  Top 0.152: JP2.19 v3.35,46.99
  Bottom 0.152: U2.14 12.1,48.76 10.82,50.04 10.21,50.04 9.6,49.43 9.6,48.67 9.3,48.36 4.72,48.36 v3.35,46.99
ANALOG-IO1
  Bottom 0.152: U2.12 10.8,47.31 10.67,47.45 9.75,47.45 9.6,47.3 9.6,45.77 8.23,44.4 2.9,44.4 2.44,44.86 2.44,48.36 JP2.20
BS  (via drill 0.2)
  Top 0.152: U1.53 19.53,13.74 19.41,13.61 19.41,10.72 v20.17,9.96 | U5.6 17.07,3.05 | 17.07,2.95 17.1,2.95 U5.6 | U5.6 17.05,3.1 19.36,3.1 19.66,3.4 19.66,3.86 20.12,4.32 20.88,4.32 v21.18,4.01
  Bottom 0.152: v20.17,9.96 19.14,9.96 U3.20 U3.21 20.42,9.25 20.93,8.74 20.93,4.27 v21.18,4.01
CAS#  (via drill 0.2)
  Top 0.152: v15.9,15.29 17.12,16.51 17.88,16.51 18.64,17.27 20.45,17.27 U1.60
  Bottom 0.152: U3.17 18.29,12.45 16.97,13.77 16.97,14.99 16.66,15.29 v15.9,15.29
CHAN0
  Top 0.152: U1.36 11.78,9.95 11.79,9.5 11.79,6.55 12.19,6.15 21.95,6.15 24.08,4.01 24.08,3.83 JP1.2
CHAN1
  Top 0.152: U1.37 12.28,10.15 12.09,9.96 12.09,6.71 12.34,6.45 22.1,6.45 23.16,5.38 23.93,6.15 23.95,6.15 JP1.3
CHAN2
  Top 0.152: U1.39 13.28,10.09 13.87,9.8 13.87,6.91 14.02,6.76 20.73,6.76 22.71,8.74 24,8.74 JP1.4
CHAN3
  Top 0.152: U1.50 18.78,8.86 19.96,7.82 20.57,7.82 23.77,11.02 23.77,11.05 JP1.5
CHAN4
  Top 0.152: U1.52 23.43,13.24 JP1.6
CHAN5
  Top 0.152: JP1.7 23.6,16.79 22.86,17.09 22.86,15.9 22.25,15.29 20.53,15.29 U1.56
CHAN6
  Top 0.152: U1.57 22.24,15.74 22.55,16.05 22.55,17.27 23.77,18.49 23.77,18.67 JP1.8
CHAN7
  Top 0.152: U1.61 22.41,17.74 23.01,18.34 23.01,22.43 JP1.9
CHAN8
  Top 0.152: U1.62 22.3,18.24 22.71,18.64 22.71,22.68 JP1.10
CHAN9
  Top 0.152: U1.68 21.39,21.24 21.49,21.34 22.05,21.34 22.4,21.69 22.4,22.91 23.01,23.52 23.01,25.53 JP1.11
CHAN10
  Top 0.152: U1.72 22.27,23.24 22.71,23.67 22.71,30.2 JP1.12
CHAN11
  Top 0.152: 20.55,23.67 U1.73 21.42,23.74 21.49,23.67 22.25,23.67 22.4,23.82 22.4,30.53 23.93,31.45 23.93,31.52 JP1.13
CHAN12
  Top 0.152: U1.82 15.78,27.45 15.6,27.64 15.6,28.14 16,28.55 18.75,28.55 23.32,33.12 23.32,33.45 JP1.14
CHAN13
  Top 0.152: U1.83 15.28,28.89 15.39,29.01 18.75,29.01 22.55,32.82 22.55,35.71 23.01,36.17 23.01,37.85 23.77,37.08 23.77,37.16 JP1.15
CHAN14
  Top 0.152: JP1.16 22.71,38.15 22.71,36.32 22.25,35.87 22.25,32.97 18.59,29.31 15.24,29.31 14.78,28.85 U1.84
CHAN15
  Top 0.152: U1.35 11.28,9.96 11.12,9.8 11.12,8.13 5.33,2.34 2.36,2.34 JP2.1
CHAN16
  Top 0.152: U1.34 10.78,8.24 5.18,2.64 2.41,2.64 JP2.2
CHAN17
  Top 0.152: U1.33 10.28,10.03 10.21,9.96 10.21,8.13 6.4,4.32 5.33,4.32 2.29,7.37 2.29,7.34 JP2.3
CHAN18
  Top 0.152: U1.32 9.78,8.15 6.25,4.62 5.51,4.62 JP2.4
CHAN19
  Top 0.152: U1.21 3.11,14.74 2.74,14.38 2.74,12.88 JP2.5
CHAN20
  Top 0.152: U1.20 2.11,15.24 JP2.6
CHAN21
  Top 0.152: U1.19 4.26,15.74 4.12,15.6 2.16,15.6 JP2.7
CHAN22
  Top 0.152: U1.13 3.26,18.74 1.98,20.02 1.83,20.02 1.37,19.56 1.37,19.13 JP2.8
CHAN23
  Top 0.152: U1.12 3.21,19.24 1.37,21.08 1.37,21.46 JP2.9
CHAN24
  Top 0.152: U1.7 3.63,21.74 JP2.10
CHAN25
  Top 0.152: U1.4 3.02,23.24 2.44,23.82 2.44,27.46 JP2.11
CHAN26
  Top 0.152: U1.3 2.98,23.74 2.74,23.98 2.74,27.71 JP2.12
CHAN27
  Top 0.152: JP2.13 1.4,31.6 1.37,31.6 3.35,29.62 7.92,29.62 8.23,29.31 8.23,27.03 8.28,26.98 U1.97
CHAN28
  Top 0.152: U1.94 9.75,26.47 9.75,27.79 8.56,28.98 8.56,29.49 8.13,29.92 5.33,29.92 2.59,32.66 2.59,34.95 2.08,35.41 JP2.14
CHAN29
  Top 0.152: JP2.15 2.9,35.18 2.9,32.82 5.49,30.23 8.38,30.23 8.99,29.62 8.99,29.01 10.06,27.94 10.06,27.48 10.21,27.33 10.21,26.51 U1.93
CHAN30
  Top 0.152: U1.89 12.34,26.5 12.34,27.33 9.14,30.53 5.64,30.53 3.2,32.97 3.2,38.15 2.44,38.91 2.44,40.13 2.03,40.44 JP2.16
CHAN31
  Top 0.152: U1.88 12.78,27.5 9.45,30.84 5.79,30.84 3.5,33.12 3.5,38.3 2.74,39.06 2.74,40.44 JP2.17
CHAN-CLK  (via drill 0.2)
  Top 0.152: U1.44 15.78,9.84 v15.44,9.65
  Bottom 0.152: JP1.1 18.59,1.27 15.39,8.28 15.39,9.65 v15.44,9.65
D0  (via drill 0.2)
  Top 0.152: U1.90 11.78,25.05 12.34,24.43 13.87,24.43 14.38,23.93 v14.38,23.82
  Bottom 0.152: v14.38,23.82 14.83,24.43 19.04,24.43 U3.2
D1  (via drill 0.2)
  Top 0.152: U1.77 18.28,23.61 v17.88,23.22
  Bottom 0.152: v17.88,23.22 17.88,23.16 18.14,22.91 18.99,22.91 U3.4
D2  (via drill 0.2)
  Top 0.152: U1.78 17.78,25.09 17.27,24.59 17.27,22.91 v17.88,22.3
  Bottom 0.152: v17.88,22.3 17.98,22.3 18.29,22 19,22 U3.5
D3  (via drill 0.2)
  Top 0.152: U1.85 14.28,25.45 v16.05,23.67
  Bottom 0.152: U3.7 19.02,20.47 17.83,20.47 16,22.3 16,23.72 v16.05,23.67
D4  (via drill 0.2)
  Top 0.152: U1.86 13.78,25.34 15.44,23.67 v15.44,21.84
  Bottom 0.152: v15.44,21.84 15.44,20.02 15.75,19.71 18.99,19.71 U3.8
D5  (via drill 0.2)
  Top 0.152: v17.27,18.19 17.27,19.25 17.58,19.56 18.34,19.56 19.1,20.32 19.1,22.61 19.25,22.76 20.46,22.76 U1.71
  Bottom 0.152: U3.10 17.41,18.05 v17.27,18.19
D6  (via drill 0.2)
  Top 0.152: v16.51,17.73 16.66,17.58 17.58,17.58 18.8,18.8 18.8,19.56 19.41,20.17 19.41,22.15 19.56,22.3 20.42,22.3 U1.70
  Bottom 0.152: U3.11 16.99,17.25 v16.51,17.73
D7  (via drill 0.2)
  Top 0.152: v15.9,17.12 17.58,17.12 18.64,18.19 18.95,18.19 19.1,18.34 19.1,19.41 19.41,19.71 20.45,19.71 U1.65
  Bottom 0.152: U3.13 18.29,15.65 18.03,15.9 18.03,16.66 17.88,16.82 16.2,16.82 v15.9,17.12
D8  (via drill 0.2)
  Top 0.152: U1.16 7.25,17.24 v8.89,15.6
  Bottom 0.152: v8.89,15.6 7.74,15.6 U3.42
D9  (via drill 0.2)
  Top 0.152: U1.15 7.66,17.74 8.15,17.25 8.76,17.25 v8.89,17.12
  Bottom 0.152: v8.89,17.12 7.82,17.12 U3.44
D10  (via drill 0.2)
  Top 0.152: U1.10 6.68,20.24 v8.89,18.03
  Bottom 0.152: v8.89,18.03 7.7,18.03 U3.45
D11  (via drill 0.2)
  Top 0.152: U1.9 7.67,20.74 8.76,19.65 8.8,19.65 v8.89,19.56
  Bottom 0.152: v8.89,19.56 7.78,19.56 U3.47
D12  (via drill 0.2)
  Top 0.152: U1.6 7.12,22.24 v8.89,20.47
  Bottom 0.152: v8.89,20.47 7.71,20.47 U3.48
D13  (via drill 0.2)
  Top 0.152: v8.89,22 8.84,22.05 8,22.05 7.3,22.74 U1.5
  Bottom 0.152: v8.89,22 7.74,22 U3.50
D14  (via drill 0.2)
  Top 0.152: U1.99 7.28,24.52 v8.89,22.91
  Bottom 0.152: v8.89,22.91 7.75,22.91 U3.51
D15  (via drill 0.2)
  Top 0.152: U1.98 7.78,24.78 8.28,24.28 v8.89,24.28
  Bottom 0.152: v8.89,24.28 8.74,24.43 7.7,24.43 U3.53
DONE
  Bottom 0.152: U2.16 13.4,44.09 12.5,43.18 7.62,43.18 6.4,41.96 6.4,40.06 R4.3
FLSH-DSBL  (via drill 0.2)
  Top 0.152: v7.16,2.95 7.99,2.95 R6.2 8.84,4.78 9.6,5.54 11.17,5.54 U5.1 | v12.19,34.04 11.89,34.04 11.28,33.43 9.91,33.43 8.99,34.34 v4.12,34.34
  Bottom 0.152: v7.16,2.95 4.12,5.99 4.12,7.37 3.94,7.54 R5.6 3.3,7.52 2.74,7.52 2.34,7.92 2.34,13.82 2.74,14.22 2.74,32.97 v4.12,34.34 | 10.15,39.12 U2.10 10.15,36.99 12.04,35.1 12.04,34.19 v12.19,34.04
FPGA-CLK  (via drill 0.2)
  Top 0.152: v15.29,13.16 15.29,13.11 15.39,13.01 15.39,12.09 15.24,11.94 15.24,11.18 15.29,11.04 U1.43
  Bottom 0.152: v15.29,13.16 13.77,23.52 13.77,29.41 10.52,36.02 9.45,37.08 9.45,38.91 9.14,39.22 7.62,39.22 7.36,38.96 R4.12
GND  (via drill 0.2, 0.41)
  Top 0.152: 11.02,38.15 11.46,38.15 U6.1 | LED1.C 3.56,42.01 v3.81,42.42 | U5.4 13.16,1.78 v13.26,1.88 | 14.52,8.18 C17.2
  Top 0.254: U1.8 4.02,21.24 v3.71,21.08 | U1.14 6.35,18.24 v6.45,18.34 | U1.18 3.98,16.24 v3.71,16.2 | v14.83,12.39 14.78,12.19 U1.42 14.78,9.46 C26.2 14.52,8.18 | U1.47 17.28,12.08 v16.97,12.39 | U1.58 21.73,16.24 v21.84,16.36 | U1.63 21.79,18.74 v21.79,18.8 | U1.69 21.59,21.74 v21.84,22 | U1.74 21.8,24.24 v21.84,24.28 | U1.80 16.78,25.16 v16.66,25.04 | U1.87 13.28,25.17 v13.16,25.04 | U1.91 11.28,25.15 v11.18,25.04 | U1.95 9.28,25.11 v9.35,25.04 | C23.2 v22.1,5.08 | C32.2 15.22,7.48 C17.2
  Top 0.305: 17.53,35.87 16.89,35.87 C35.2 | 18.5,34.04 C5.2
  Top 0.406: v11.79,37.24 11.73,37.44 U6.1 11.76,38.46 12.24,38.46 12.55,38.15 v12.55,36.78 12.55,36.02 13.13,35.44 C24.2 13.69,35.44 14.17,34.95 v14.17,34.04 | 11.02,38.15 10.87,37.85 v10.87,37.24 10.87,36.46 C4.2 | v3.81,42.42 3.81,43.17 C1.2 | v13.72,43.18 14.94,43.18 U7.1 | v15.39,44.55 15.39,43.79 15.37,43.76 15.39,43.48 15.54,43.64 15.7,43.48 16,43.48 16.2,43.84 v16.2,44.55 | v18.64,36.78 17.98,36.78 17.53,35.87 | 18.5,34.04 v17.27,34.04 17.27,35.05 17.22,35.1 16.61,35.1 16.31,35.41 16.46,35.41 | C35.2 16.43,34.06 v16.46,34.04
  Top 0.508: X1.5 11.1,46.56 10.52,47.14 v10.52,48.21 v10.52,49.28
  Bottom 0.152: U3.54 9.14,25.25 v9.35,25.04 | C20.2 5.12,13.77 | C12.2 20.38,22.3 | U3.28 7.82,4.32 7.69,4.32 | 7.69,3.73 v7.67,3.71 | 20.14,10.85 v20.17,10.87 | 21.13,38.98 C3.2 21.08,38.9 | v17.88,14.22 18.06,14.05 U3.15 19.07,14.07 19.81,14.07 19.96,13.92 19.96,13.77 20.42,13.31 C30.2 | C19.2 | R10.2 20.98,29.87 v21.18,30.07 | R5.7 R5.8 3.32,9.31 v3.35,9.96 | 6.4,23.67 v6.45,23.52 | 4.42,24.28 4.26,24.13 4.26,23.87 C22.2 | 5.03,24.28 C33.2 | C31.2 6.34,18.23 v6.45,18.34 | C29.2 20.58,18.2 20.88,18.49 21.49,18.49 v21.79,18.8 | U3.6 18.12,21.25 v17.83,21.39 | C21.2 4.01,19.05 | 5.14,21.08 C18.2 | 12.74,28.15 C25.2 12.99,25.21 v13.16,25.04 | C28.2 17.68,29.86 | C9.2 15.14,29.96 | R8.2 v8.23,45.77 | 18.71,45.66 v18.75,45.62 | C2.2 19.43,44.28 | C34.2 4.43,11.64 | R5.4 5.12,6.06 v5.18,5.99
  Bottom 0.254: U3.52 6.58,23.65 v6.45,23.52 | U3.46 6.81,18.85 v6.45,19.25 | U3.41 6.77,14.85 v6.45,14.53 | v6.45,14.53 6.45,14.38 5.84,13.77 5.12,13.77 | v21.84,22 21.54,22.3 20.38,22.3 | 7.69,4.32 7.69,3.73 | U3.19 20.14,10.85 | C34.2 4.43,13.08 C20.2 | 21.13,38.98 Q1.2 | v20.62,37.85 21.08,38.3 21.08,38.9 | U3.39 6.82,13.25 6.6,13.46 6.6,14.38 v6.45,14.53 | U3.12 C19.2 | C19.2 21.76,16.45 v21.84,16.36 | C33.2 6.21,24.32 6.4,24.13 6.4,23.67 | 4.42,24.28 5.03,24.28 | C14.2 20.73,22.62 C12.2 | C13.2 21.07,9.97 v20.17,10.87 | v3.71,21.08 5.14,21.08 | C31.2 4.84,18.23 4.01,19.05 | 12.74,28.15 C11.2 12.74,29.99 v12.5,30.23 | v10.67,30.53 10.58,30.62 C10.2 9.15,30.11 C15.2 | 17.68,29.86 C7.2 | v17.58,30.84 C28.2 | v16.36,30.84 C27.2 15.14,29.96 | C8.2 18.71,45.66 | 19.43,44.28 Q1.4 | C2.2 19.37,44.99 v18.75,45.62 | C16.2 v3.05,11.02 3.81,11.02 4.43,11.64 | U2.20 16,44.76 v16.2,44.55
  Bottom 0.305: C6.2 18.14,36.42 v18.64,36.78
  pour Route4: 1.02,1.02 24.38,1.02 24.38,49.63 1.02,49.63
LED
  Bottom 0.152: U2.5 13.4,41.36 12.04,42.72 7.77,42.72 6.86,41.81 R4.4
N$1  (via drill 0.2)
  Top 0.152: v4.93,33.12 4.93,32.21 5.99,31.14 13.31,31.14 v13.92,30.53 | v19.41,26.42 18.8,26.42 U1.76
  Bottom 0.152: R4.16 5.36,33.56 v4.93,33.12 | R10.1 20.41,26.42 v19.41,26.42 19.25,26.57 14.78,26.57 14.17,27.18 14.17,30.23 v13.92,30.53
N$2  (via drill 0.2)
  Top 0.152: v5.08,25.5 U1.1 | v4.57,35.87 v7.32,35.87
  Bottom 0.152: v7.32,35.87 8.38,36.93 8.38,38.4 R4.10 | v4.57,35.87 4.57,35.71 4.88,35.41 4.88,34.04 4.27,33.43 4.27,26.31 v5.08,25.5
N$3  (via drill 0.2)
  Top 0.152: v7.37,28.85 7.06,28.85 6.3,28.09 6.3,24.43 6.15,24.28 5.12,24.28 U1.2
  Bottom 0.152: R4.9 8.86,37.06 10.21,35.71 10.21,32.36 9.6,31.75 7.77,31.75 7.32,31.29 7.32,28.8 v7.37,28.85
N$4  (via drill 0.2)
  Top 0.152: v5.69,32.51 5.69,32 6.25,31.45 18.8,31.45 v18.9,31.34 | v21.54,25.35 21.54,24.89 21.39,24.74 U1.75
  Bottom 0.152: R4.15 5.86,32.68 v5.69,32.51 | v21.54,25.35 21.54,25.4 21.79,25.65 21.79,31.29 21.64,31.45 19.05,31.45 v18.9,31.34
N$5  (via drill 0.2)
  Top 0.152: v7.06,27.94 6.76,27.64 6.76,26.46 U1.100
  Bottom 0.152: v7.06,27.94 7.01,27.99 | v7.06,27.94 6.71,28.3 6.71,36.17 7.92,37.39 7.92,38.35 R4.11 | R5.5 3.32,6.18 6.25,3.25 6.25,2.34 6.55,2.03 9.14,2.03 9.91,2.79 9.91,12.85 11.12,14.07 11.12,14.99 10.52,15.6 10.52,25.65 9.3,26.87 8.13,26.87 v7.06,27.94
N$6  (via drill 0.2)
  Top 0.152: v10.41,14.53 14.78,14.53 15.7,13.61 18.44,13.61 19.07,14.24 U1.54
  Bottom 0.152: v10.41,14.53 9.96,14.99 9.96,25.5 9.04,26.42 6.91,26.42 6.36,26.96 R4.14
N$7
  Bottom 0.152: U2.6 12.75,41.25 11.73,42.27 8.08,42.27 7.32,41.5 7.32,40.06 R4.5
N$8  (via drill 0.2)
  Top 0.152: U5.2 v13.41,4.32 | R9.1 15.24,2.49 v14.63,3.1
  Bottom 0.152: v13.41,4.32 v14.63,3.1
N$11  (via drill 0.2)
  Top 0.152: LED1.A 3.56,38.91 4.17,38.3 6.55,38.3 7.01,37.85 v7.01,37.39
  Bottom 0.152: R4.13 6.86,37.54 v7.01,37.39
OSC1
  Bottom 0.152: U2.2 15.35,40.19 15.6,40.44 16.36,40.44 16.82,39.98 18.34,39.98 18.64,40.28 19.14,40.28 Q1.3 | Q1.3 19.22,40.56 | Q1.3 19.37,40.51
  Bottom 0.254: 19.37,40.51 C3.1
OSC2
  Bottom 0.152: U2.3 14.68,38.98 14.68,40.28 15.3,40.91 R2.1 R2.2 | R2.2 17.84,42.61 18.8,41.66 20.02,41.66 Q1.1 | R2.2 17.77,42.61 | 21.13,44.28 C2.1
  Bottom 0.254: Q1.1 21.13,44.28
PROG#
  Bottom 0.152: U2.7 12.1,41.14 11.28,41.96 8.53,41.96 7.92,41.35 7.92,40.08 R4.6
RAS#  (via drill 0.2)
  Top 0.152: v15.9,14.38 16.51,14.99 16.51,15.44 17.27,16.2 18.03,16.2 18.64,16.82 20.17,16.82 20.4,16.66 U1.59
  Bottom 0.152: U3.18 18.32,11.65 18.03,11.94 18.03,12.24 16.66,13.61 16.66,14.22 16.51,14.38 v15.9,14.38
RST#
  Bottom 0.152: 14.07,38.94 U2.4 14.05,37.88 13.87,37.69 13.87,36.54 R1.1 14.39,35.19 14.63,34.95 17.98,34.95 19.36,36.32 19.36,36.93 19.66,37.24 21.18,37.24 21.95,38 21.95,39.52 22.1,39.67 22.1,45.16 21.79,45.47 20.57,45.47 20.27,45.77 20.27,47.9 20.57,48.21 22.81,48.21 JP1.20
SDRAM-CLK  (via drill 0.2)
  Top 0.152: U1.40 13.78,12.69 13.46,13.01 11.58,13.01 11.28,13.31 | 11.28,13.31 9.2,13.31 v9.04,13.16 | U1.41 14.28,13.36 14.02,13.61 11.58,13.61 11.28,13.31
  Bottom 0.152: v9.04,13.16 9.04,12.85 8.74,12.55 7.79,12.55 U3.38
SENSE-USB
  Bottom 0.152: 12.7,46.27 U2.15 12.75,48.87 11.28,50.34 10.06,50.34 8.99,49.28 8.29,49.28 R8.1 R7.1
TCK  (via drill 0.2)
  Top 0.152: v10.06,44.09 14.02,44.09 15.09,45.16 17.37,45.16 18.59,46.38 18.59,46.51 JP3.2
  Bottom 0.152: 5.36,39.98 R4.1 5.33,40.05 5.33,41.81 7.32,43.79 9.91,43.79 10.15,44.04 | U2.11 10.15,44.04 | 10.15,44.04 v10.06,44.09
TDI  (via drill 0.2)
  Top 0.152: v10.06,41.05 10.06,41.35 10.36,41.66 13.56,41.66 13.87,41.96 17.07,41.96 21.49,46.38 21.49,46.86 JP3.1
  Bottom 0.152: 8.84,40.04 R4.8 9.33,40.02 9.6,40.28 10.06,40.28 | 10.06,40.28 10.67,40.28 10.82,40.13 10.82,38.98 U2.9 | v10.06,41.05 10.06,40.28
TDO  (via drill 0.2)
  Top 0.152: v11.43,47.75 13.87,47.75 14.48,48.36 14.48,49.12 v14.78,49.43
  Bottom 0.152: R4.2 5.79,40.09 5.79,41.81 7.47,43.48 10.97,43.48 11.45,43.96 U2.13 11.45,47.73 v11.43,47.75 | v14.78,49.43 18.97,49.43 JP3.4
TMS  (via drill 0.2)
  Top 0.152: v8.99,41.05 9.14,41.05 10.06,41.96 13.26,41.96 13.72,42.42 16.76,42.42 20.27,45.92 20.27,48.18 JP3.3
  Bottom 0.152: U2.8 11.45,41.18 10.97,41.66 9.6,41.66 v8.99,41.05 8.84,41.05 8.38,40.59 8.38,40.04 R4.7
USB_D+  (via drill 0.2)
  Top 0.152: 12.65,46.43 X1.3 12.7,46.74 13.41,47.45 14.33,47.45 14.48,47.6 14.48,47.9 14.78,48.21 14.78,48.36 v15.09,48.67
  Bottom 0.152: v15.09,48.67 15.39,48.67 15.7,48.36 15.7,47.45 15.39,47.14 15.39,46.25 U2.19
USB_D-  (via drill 0.2)
  Top 0.152: X1.2 13.56,46.44 13.56,46.84 13.84,47.12 14.45,47.12 v15.09,47.7
  Bottom 0.152: U2.18 14.7,47.37 v15.09,47.7
VUSB
  Bottom 0.152: 17.72,43.94 C8.1
  Bottom 0.254: U2.17 14.05,44.11 14.22,43.94 17.72,43.94
WE#  (via drill 0.2)
  Top 0.152: v15.9,16.2 16.51,16.82 17.73,16.82 18.8,17.88 19.25,17.88 19.41,18.03 19.41,19.1 19.56,19.25 20.47,19.25 U1.64
  Bottom 0.152: U3.16 17.94,13.25 17.27,13.92 17.27,15.9 16.97,16.2 v15.9,16.2
(copper drawn outside any net)
  shapes: Route3 circle x3

### Text on the board
tPlace: TDO | AIO1 | TMS | RS | TCK | TDI | AIO0 | 1.2 | 5.0 | GND | C31 | 3.3 | CH30 | CH14 | CH29 | CH13 | CH28 | CH12 | CH27 | CH11 | CH26 | CH10 | CH25 | CH9 | CH24 | CH8 | CH23 | CH7 | CH22 | CH6 | CH21 | CH5 | CH20 | CH4 | XESS | CH19 | CH3 | CH18 | c 2010 | CH2 | CH17 | CH1 | CH16 | CH0 | CH15 | CH-CLK
bPlace: +5V | +3.3V | +1.2V
tDocu: ANALOG-IO1 | RST# | ANALOG-IO0 | +1.2V | +5V | GND | p88 CHAN31 | +3.3V | p89 CHAN30 | CHAN14 p84 | p93 CHAN29 | CHAN13 p83 | p94 CHAN28 | CHAN12 p82 | p97 CHAN27 | CHAN11 p73 | p3 CHAN26 | CHAN10 p72 | p4 CHAN25 | CHAN9 p68 | p7 CHAN24 | CHAN8 p62 | p12 CHAN23 | CHAN7 p61 | p13 CHAN22 | CHAN6 p57 | p19 CHAN21 | CHAN5 p56 | p20 CHAN20 | CHAN4 p52 | p21 CHAN19 | CHAN3 p50 | p32 CHAN18 | CHAN2 p39 | p33 CHAN17 | CHAN1 p37 | p34 CHAN16 | CHAN0 p36 | p35 CHAN15 | CHAN-CLK p44 | 2010, XESS Corp. | All rights reserved. | Licensed under a Creative Commons | Attribution-Share-Alike Unported License. | See creativecommons.org/licenses/by-sa/3.0/